# EAGLE design sGPSDO_MCU_1V1 (EAGLE 7.7.0)
sGPSDO - MCU board for the ST32L432KC / STM32 Nucleo board.
Assembly variants: Std, noDCF77

## Sheet 1 of 6: Sockets
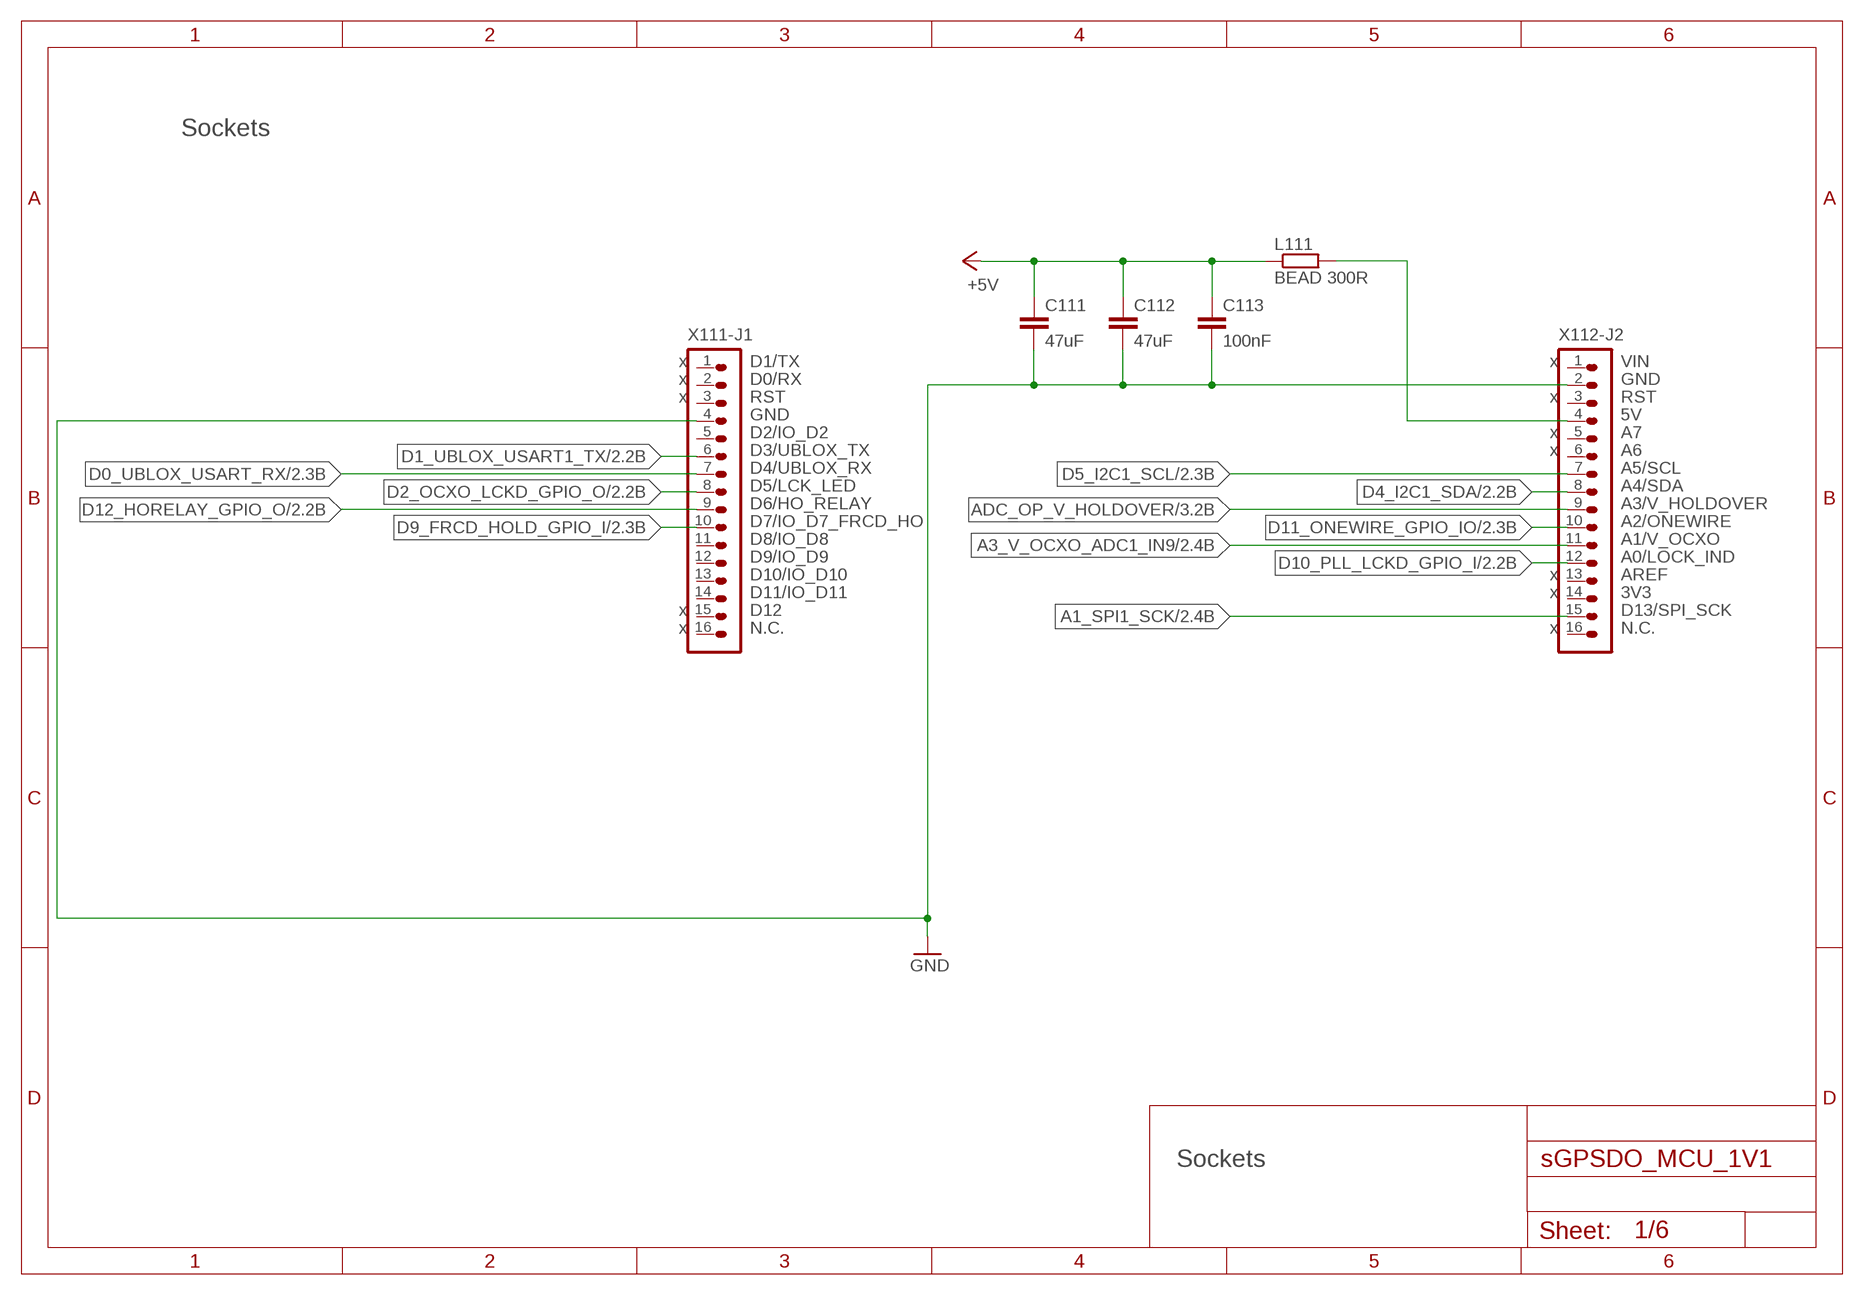
[diagram p0: schematic, sheet 1]

### Parts
C111  47uF  C-EUC0805  [C0805]
C112  47uF  C-EUC0805  [C0805]
C113  100nF  C-EUC0805  [C0805]
L111  BEAD 300R  R-EU_R1206  [R1206]
X111-J1  HEADER-1X16  [1X16]
X112-J2  HEADER-1X16  [1X16]

### Nets
+5V: C111.1 C112.1 C113.1 L111.1 ; also sheet 2,3,4,5,6
A1_SPI1_SCK: X112-J2.15 ; also sheet 2,6
A3_V_OCXO_ADC1_IN9: X112-J2.11 ; also sheet 2
ADC_OP_V_HOLDOVER: X112-J2.9 ; also sheet 3
D0_UBLOX_USART_RX: X111-J1.7 ; also sheet 2
D1_UBLOX_USART1_TX: X111-J1.6 ; also sheet 2
D2_OCXO_LCKD_GPIO_O: X111-J1.8 ; also sheet 2
D4_I2C1_SDA: X112-J2.8 ; also sheet 2
D5_I2C1_SCL: X112-J2.7 ; also sheet 2
D9_FRCD_HOLD_GPIO_I: X111-J1.10 ; also sheet 2
D10_PLL_LCKD_GPIO_I: X112-J2.12 ; also sheet 2
D11_ONEWIRE_GPIO_IO: X112-J2.10 ; also sheet 2
D12_HORELAY_GPIO_O: X111-J1.9 ; also sheet 2
GND: C111.2 C112.2 C113.2 X111-J1.4 X112-J2.2 ; also sheet 2,3,4,5,6
N112: L111.2 X112-J2.4
Unconnected: X111-J1.1 X111-J1.2 X111-J1.3 X111-J1.5 X111-J1.11 X111-J1.12 X111-J1.13 X111-J1.14 X111-J1.15 X111-J1.16 X112-J2.1 X112-J2.3 X112-J2.5 X112-J2.6 X112-J2.13 X112-J2.14 X112-J2.16

### Notes on the sheet
- Sockets
- x | D1/TX | x | VIN
- x | D0/RX | GND
- x | RST | x | RST
- GND | 5V
- D2/IO_D2 | x | A7
- D3/UBLOX_TX | x | A6
- D4/UBLOX_RX | A5/SCL
- D5/LCK_LED | A4/SDA
- D6/HO_RELAY | A3/V_HOLDOVER
- D7/IO_D7_FRCD_HO | A2/ONEWIRE
- D8/IO_D8 | A1/V_OCXO
- D9/IO_D9 | A0/LOCK_IND
- D10/IO_D10 | x | AREF
- D11/IO_D11 | x | 3V3
- x | D12 | D13/SPI_SCK
- x | N.C. | x | N.C.
- Sockets

## Sheet 2 of 6: MCU
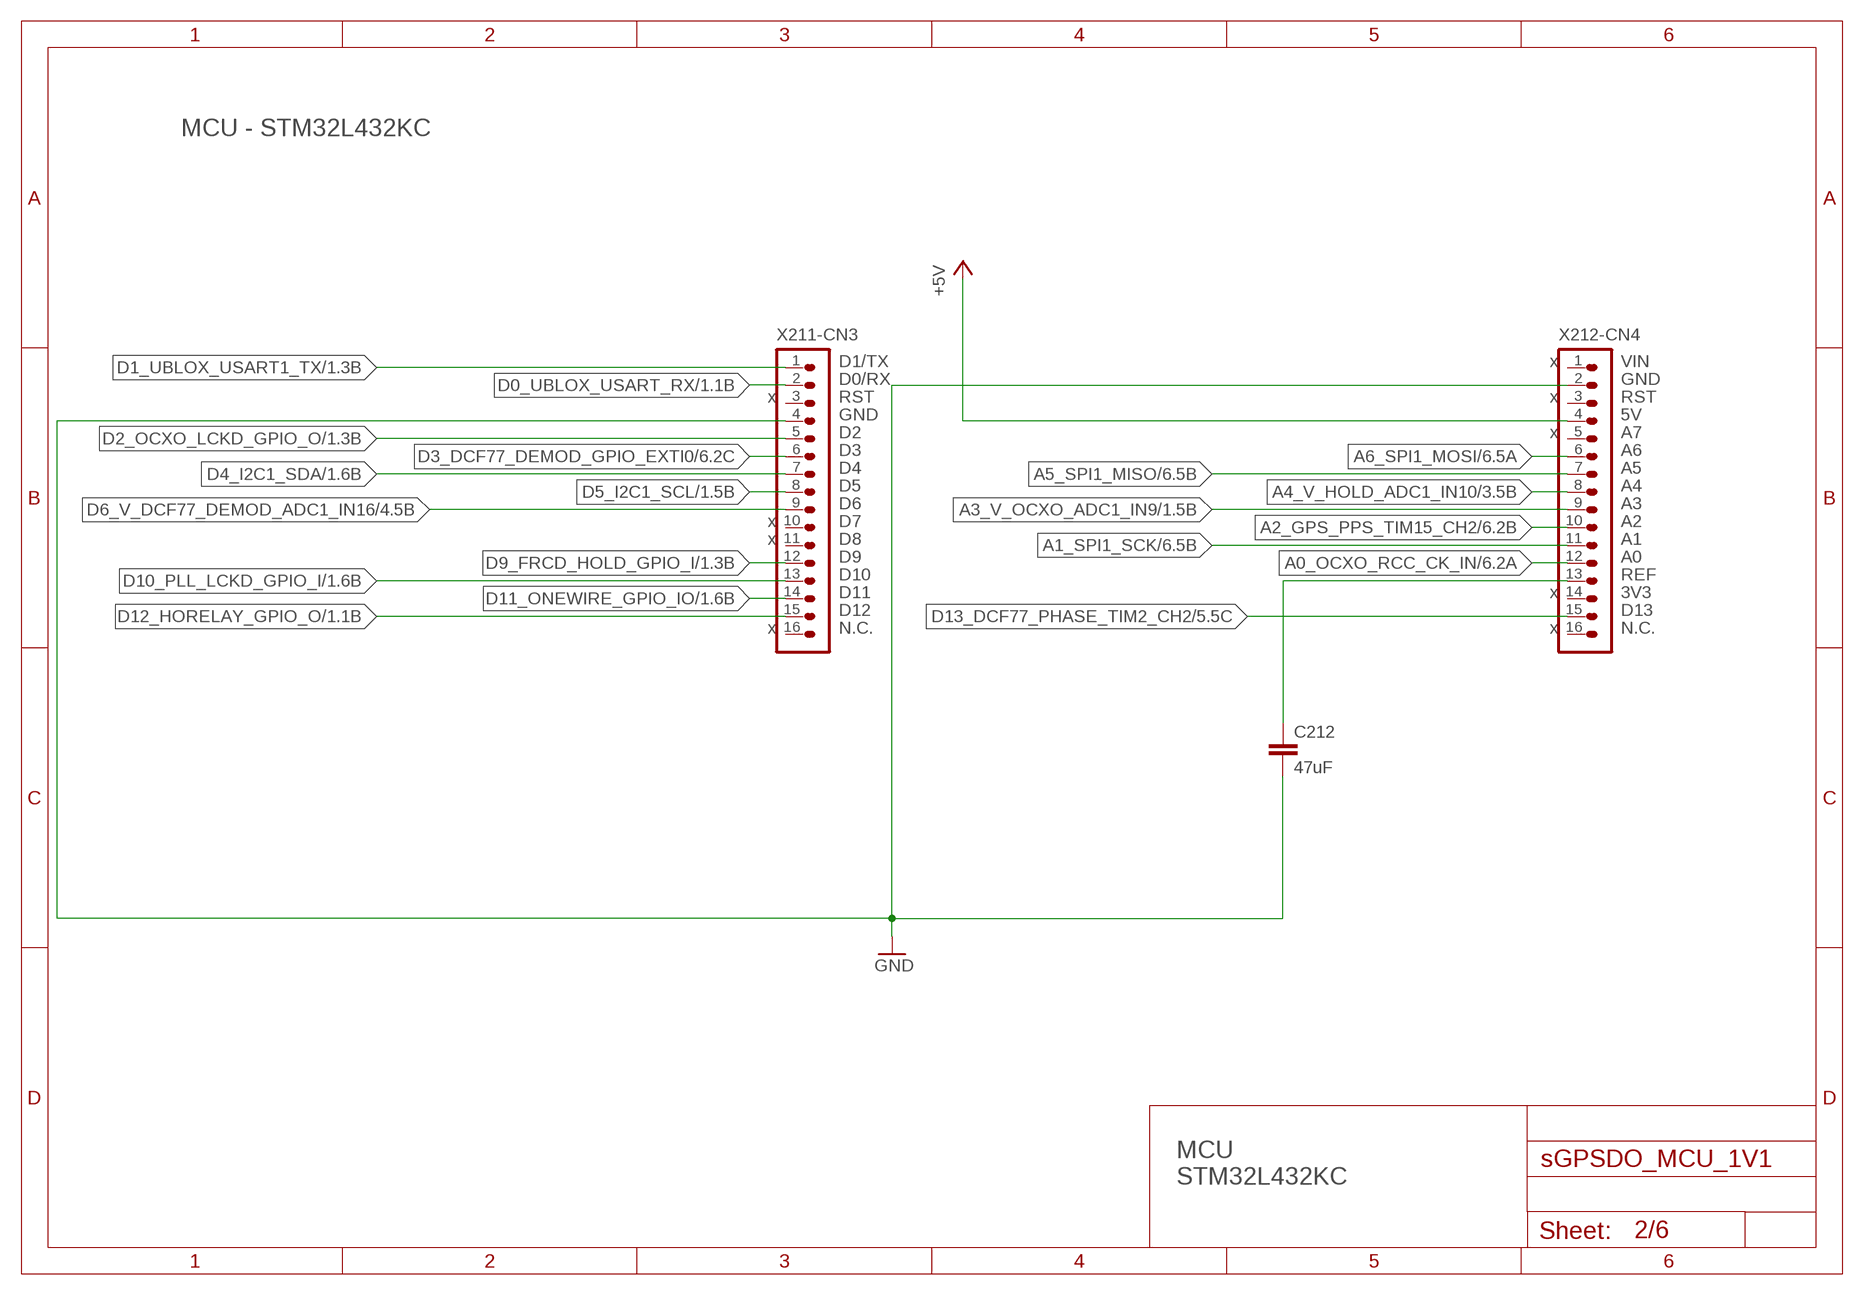
[diagram p1: schematic, sheet 2]

### Parts
C212  47uF  C-EUC0805  [C0805]
X211-CN3  HEADER-1X16  [1X16]
X212-CN4  HEADER-1X16  [1X16]

### Nets
+5V: X212-CN4.4 ; also sheet 1,3,4,5,6
A0_OCXO_RCC_CK_IN: X212-CN4.12 ; also sheet 6
A1_SPI1_SCK: X212-CN4.11 ; also sheet 1,6
A2_GPS_PPS_TIM15_CH2: X212-CN4.10 ; also sheet 6
A3_V_OCXO_ADC1_IN9: X212-CN4.9 ; also sheet 1
A4_V_HOLD_ADC1_IN10: X212-CN4.8 ; also sheet 3
A5_SPI1_MISO: X212-CN4.7 ; also sheet 6
A6_SPI1_MOSI: X212-CN4.6 ; also sheet 6
D0_UBLOX_USART_RX: X211-CN3.2 ; also sheet 1
D1_UBLOX_USART1_TX: X211-CN3.1 ; also sheet 1
D2_OCXO_LCKD_GPIO_O: X211-CN3.5 ; also sheet 1
D3_DCF77_DEMOD_GPIO_EXTI0: X211-CN3.6 ; also sheet 6
D4_I2C1_SDA: X211-CN3.7 ; also sheet 1
D5_I2C1_SCL: X211-CN3.8 ; also sheet 1
D6_V_DCF77_DEMOD_ADC1_IN16: X211-CN3.9 ; also sheet 4
D9_FRCD_HOLD_GPIO_I: X211-CN3.12 ; also sheet 1
D10_PLL_LCKD_GPIO_I: X211-CN3.13 ; also sheet 1
D11_ONEWIRE_GPIO_IO: X211-CN3.14 ; also sheet 1
D12_HORELAY_GPIO_O: X211-CN3.15 ; also sheet 1
D13_DCF77_PHASE_TIM2_CH2: X212-CN4.15 ; also sheet 5
GND: C212.2 X211-CN3.4 X212-CN4.2 ; also sheet 1,3,4,5,6
VREF: C212.1 X212-CN4.13
Unconnected: X211-CN3.3 X211-CN3.10 X211-CN3.11 X211-CN3.16 X212-CN4.1 X212-CN4.3 X212-CN4.5 X212-CN4.14 X212-CN4.16

### Notes on the sheet
- MCU - STM32L432KC
- D1/TX | x | VIN
- D0/RX | GND
- x | RST | x | RST
- GND | 5V
- D2 | x | A7
- D3 | A6
- D4 | A5
- D5 | A4
- D6 | A3
- x | D7 | A2
- x | D8 | A1
- D9 | A0
- D10 | REF
- D11 | x | 3V3
- D12 | D13
- x | N.C. | x | N.C.
- MCU
  STM32L432KC

## Sheet 3 of 6: ADC HOLDOVER Voltage
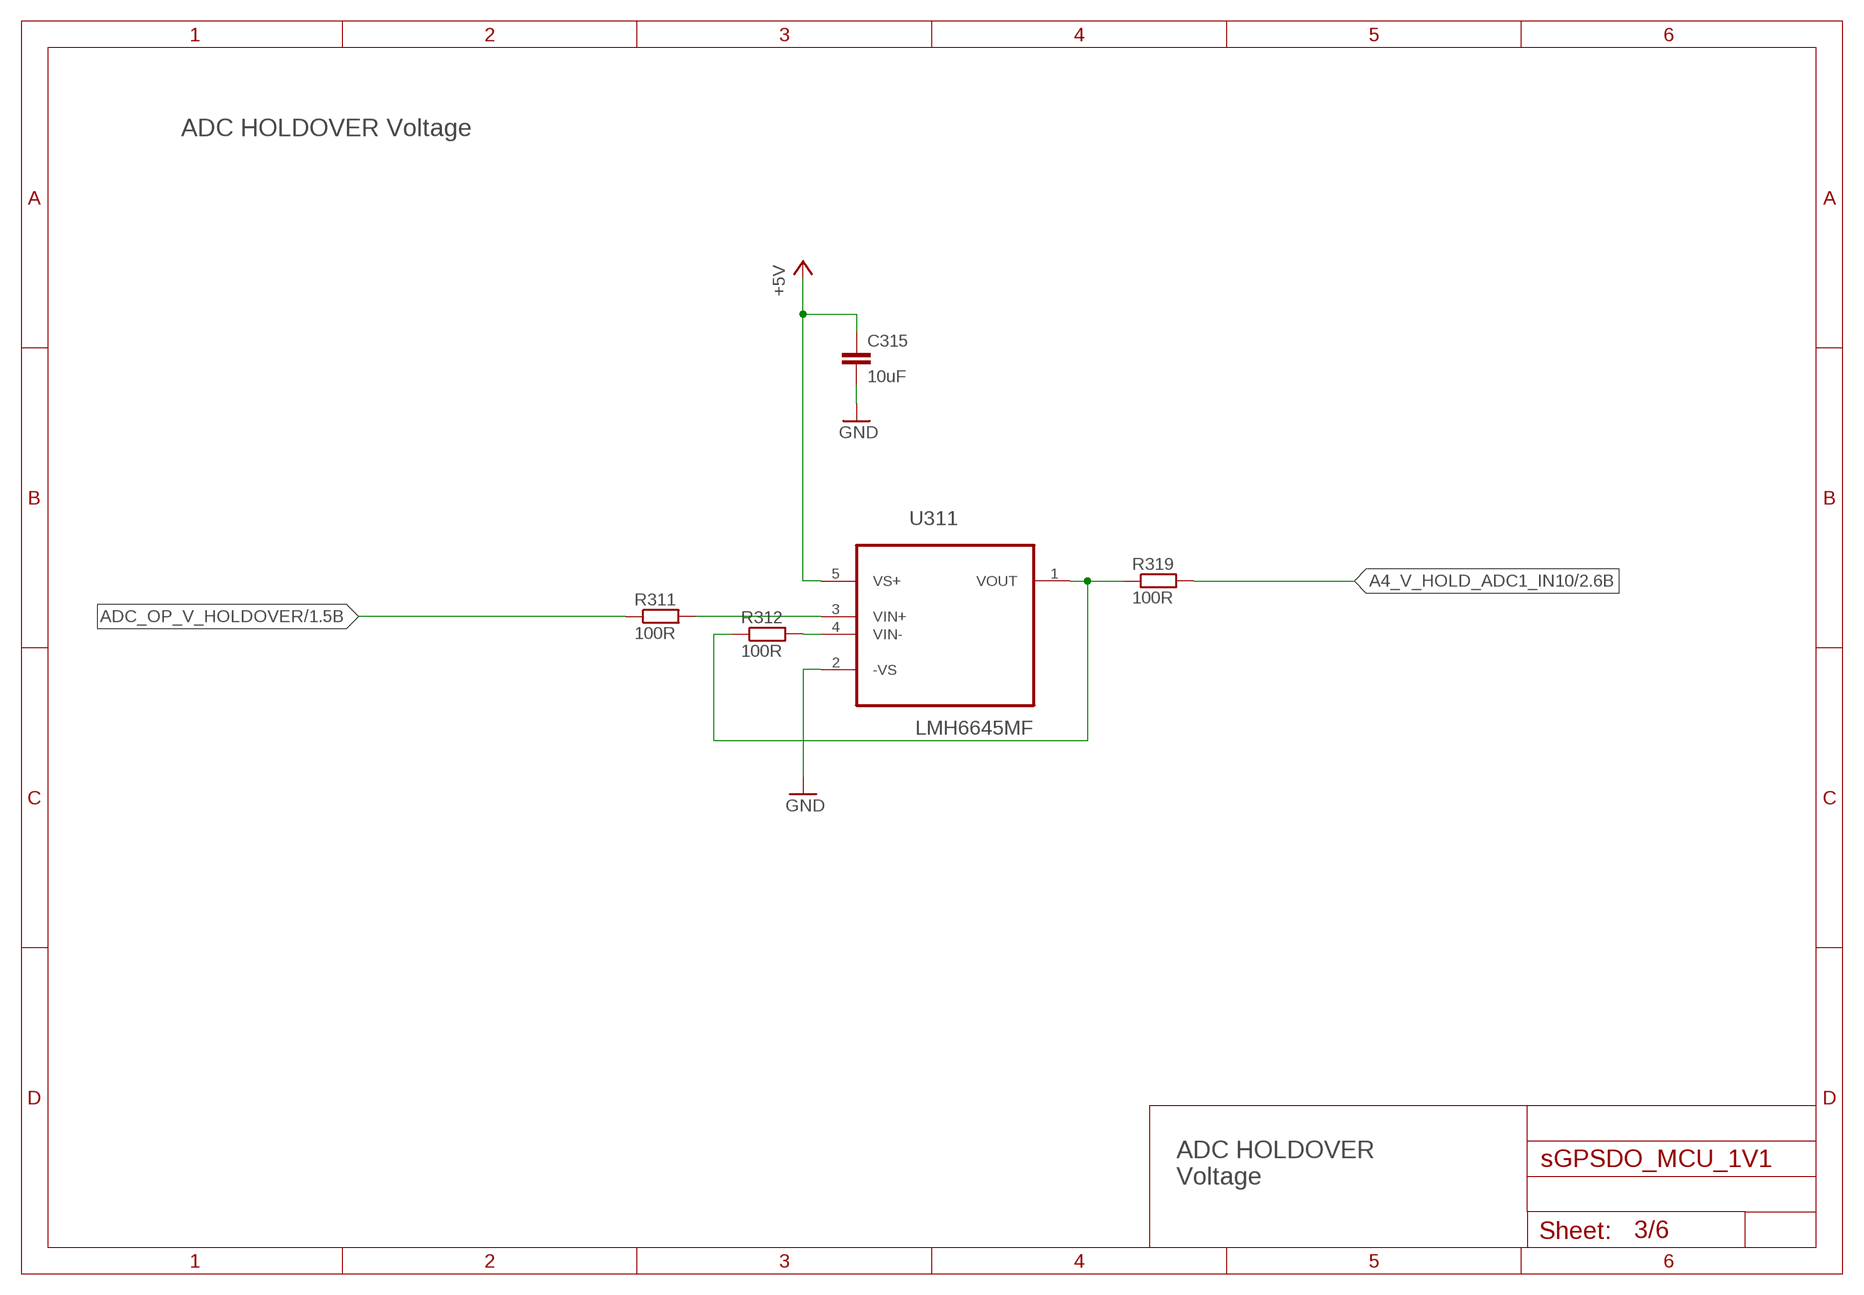
[diagram p2: schematic, sheet 3]

### Parts
C315  10uF  C-EUC0805  [C0805]
R311  100R  R-EU_R0805  [R0805]
R312  100R  R-EU_R0805  [R0805]
R319  100R  R-EU_R0805  [R0805]
U311  LMH6645MF  [SOT-23-5]

### Nets
+5V: C315.1 U311.5(VS+) ; also sheet 1,2,4,5,6
A4_V_HOLD_ADC1_IN10: R319.2 ; also sheet 2
ADC_OP_V_HOLDOVER: R311.1 ; also sheet 1
GND: C315.2 U311.2(-VS) ; also sheet 1,2,4,5,6
N311: R311.2 U311.3(VIN+)
N312: R312.2 U311.4(VIN-)
N319: R312.1 R319.1 U311.1(VOUT)

### Notes on the sheet
- ADC HOLDOVER Voltage
- ADC HOLDOVER
  Voltage

## Sheet 4 of 6: ADC DCF77 DEMOD Voltage
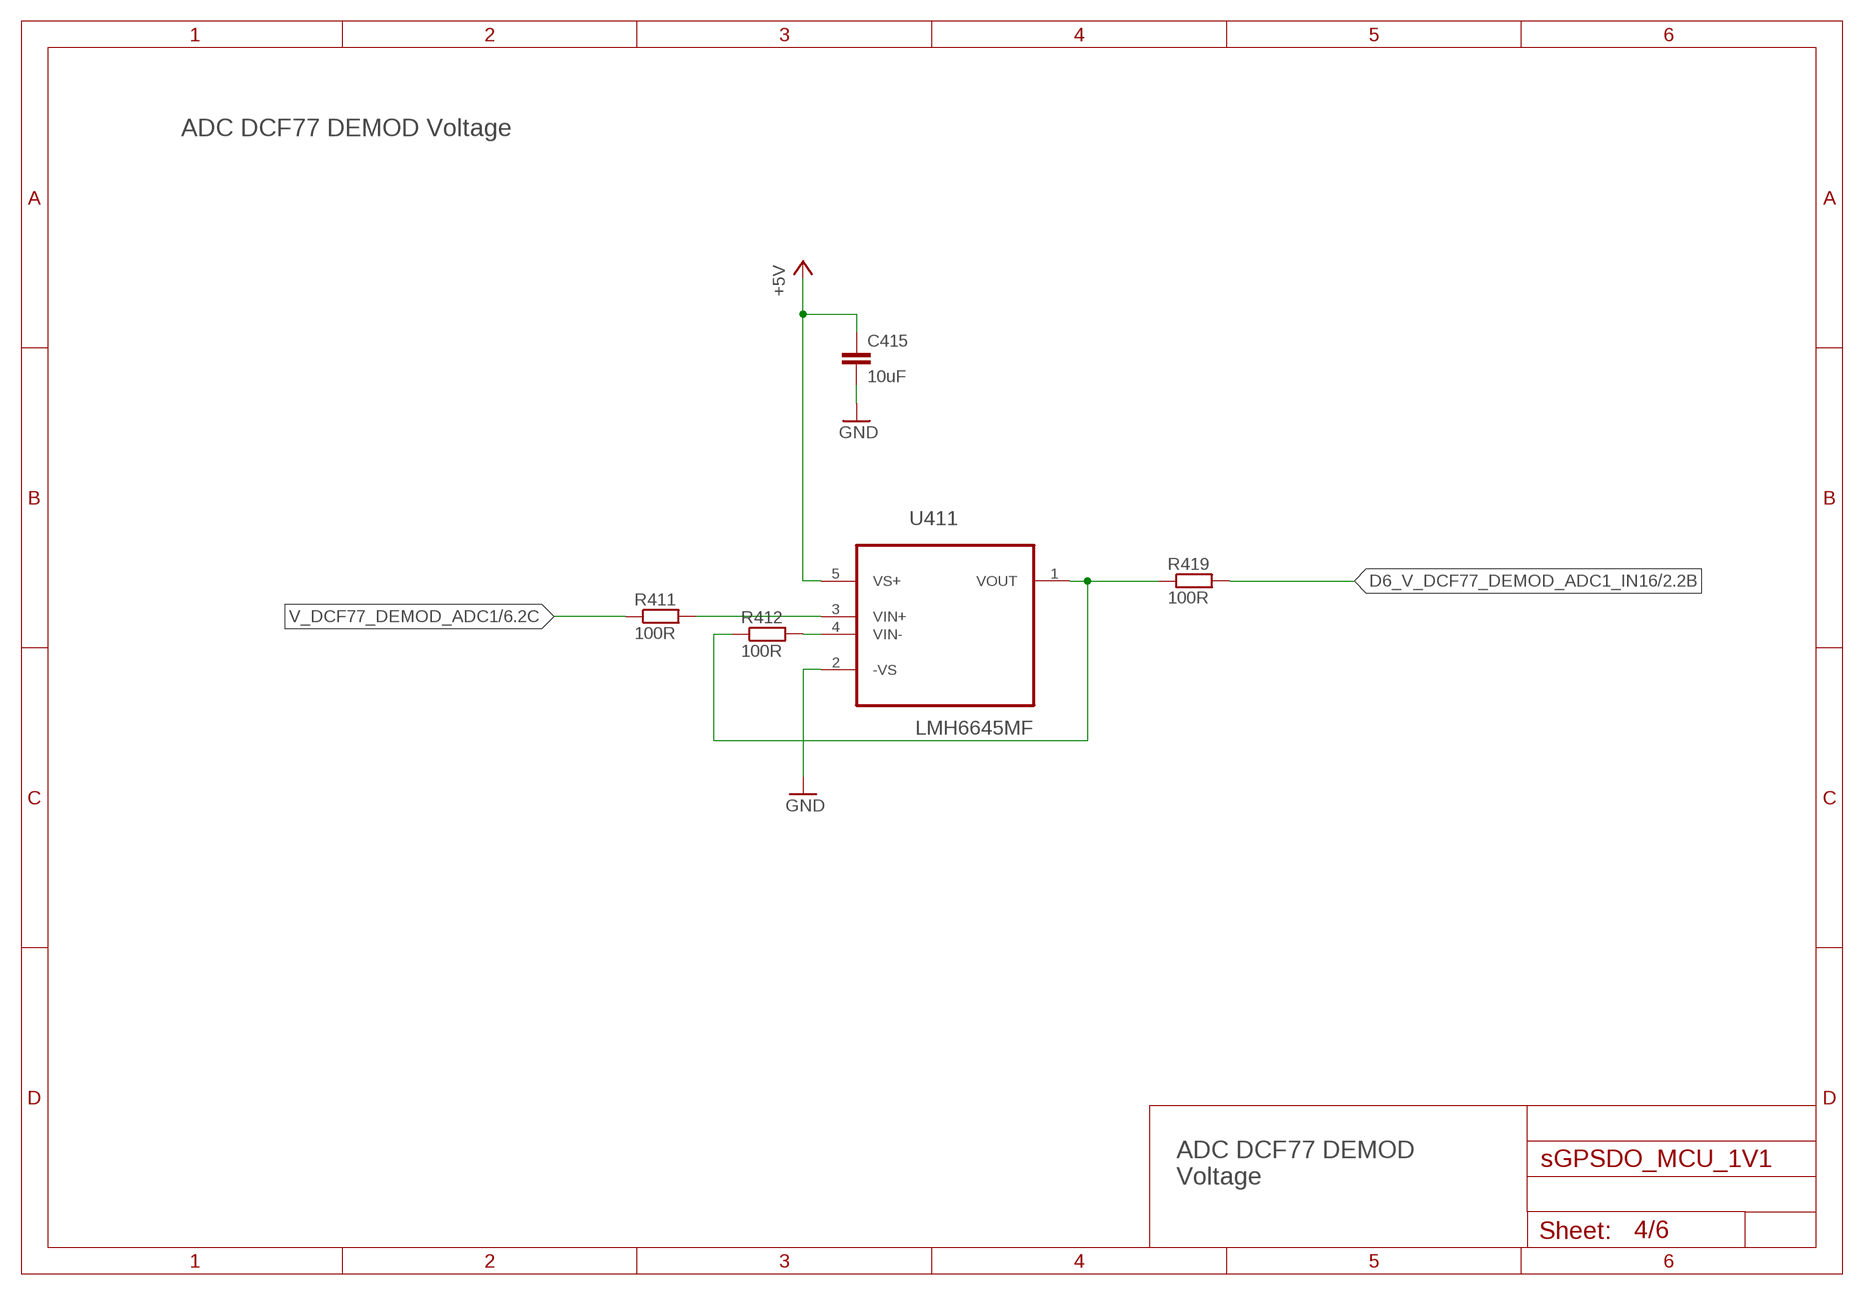
[diagram p3: schematic, sheet 4]

### Parts
C415  10uF  C-EUC0805  [C0805]
R411  100R  R-EU_R0805  [R0805]
R412  100R  R-EU_R0805  [R0805]
R419  100R  R-EU_R0805  [R0805]
U411  LMH6645MF  [SOT-23-5]

### Nets
+5V: C415.1 U411.5(VS+) ; also sheet 1,2,3,5,6
D6_V_DCF77_DEMOD_ADC1_IN16: R419.2 ; also sheet 2
GND: C415.2 U411.2(-VS) ; also sheet 1,2,3,5,6
N411: R411.2 U411.3(VIN+)
N412: R412.2 U411.4(VIN-)
N419: R412.1 R419.1 U411.1(VOUT)
V_DCF77_DEMOD_ADC1: R411.1 ; also sheet 6

### Notes on the sheet
- ADC DCF77 DEMOD Voltage
- ADC DCF77 DEMOD
  Voltage

## Sheet 5 of 6: Divider 31:1
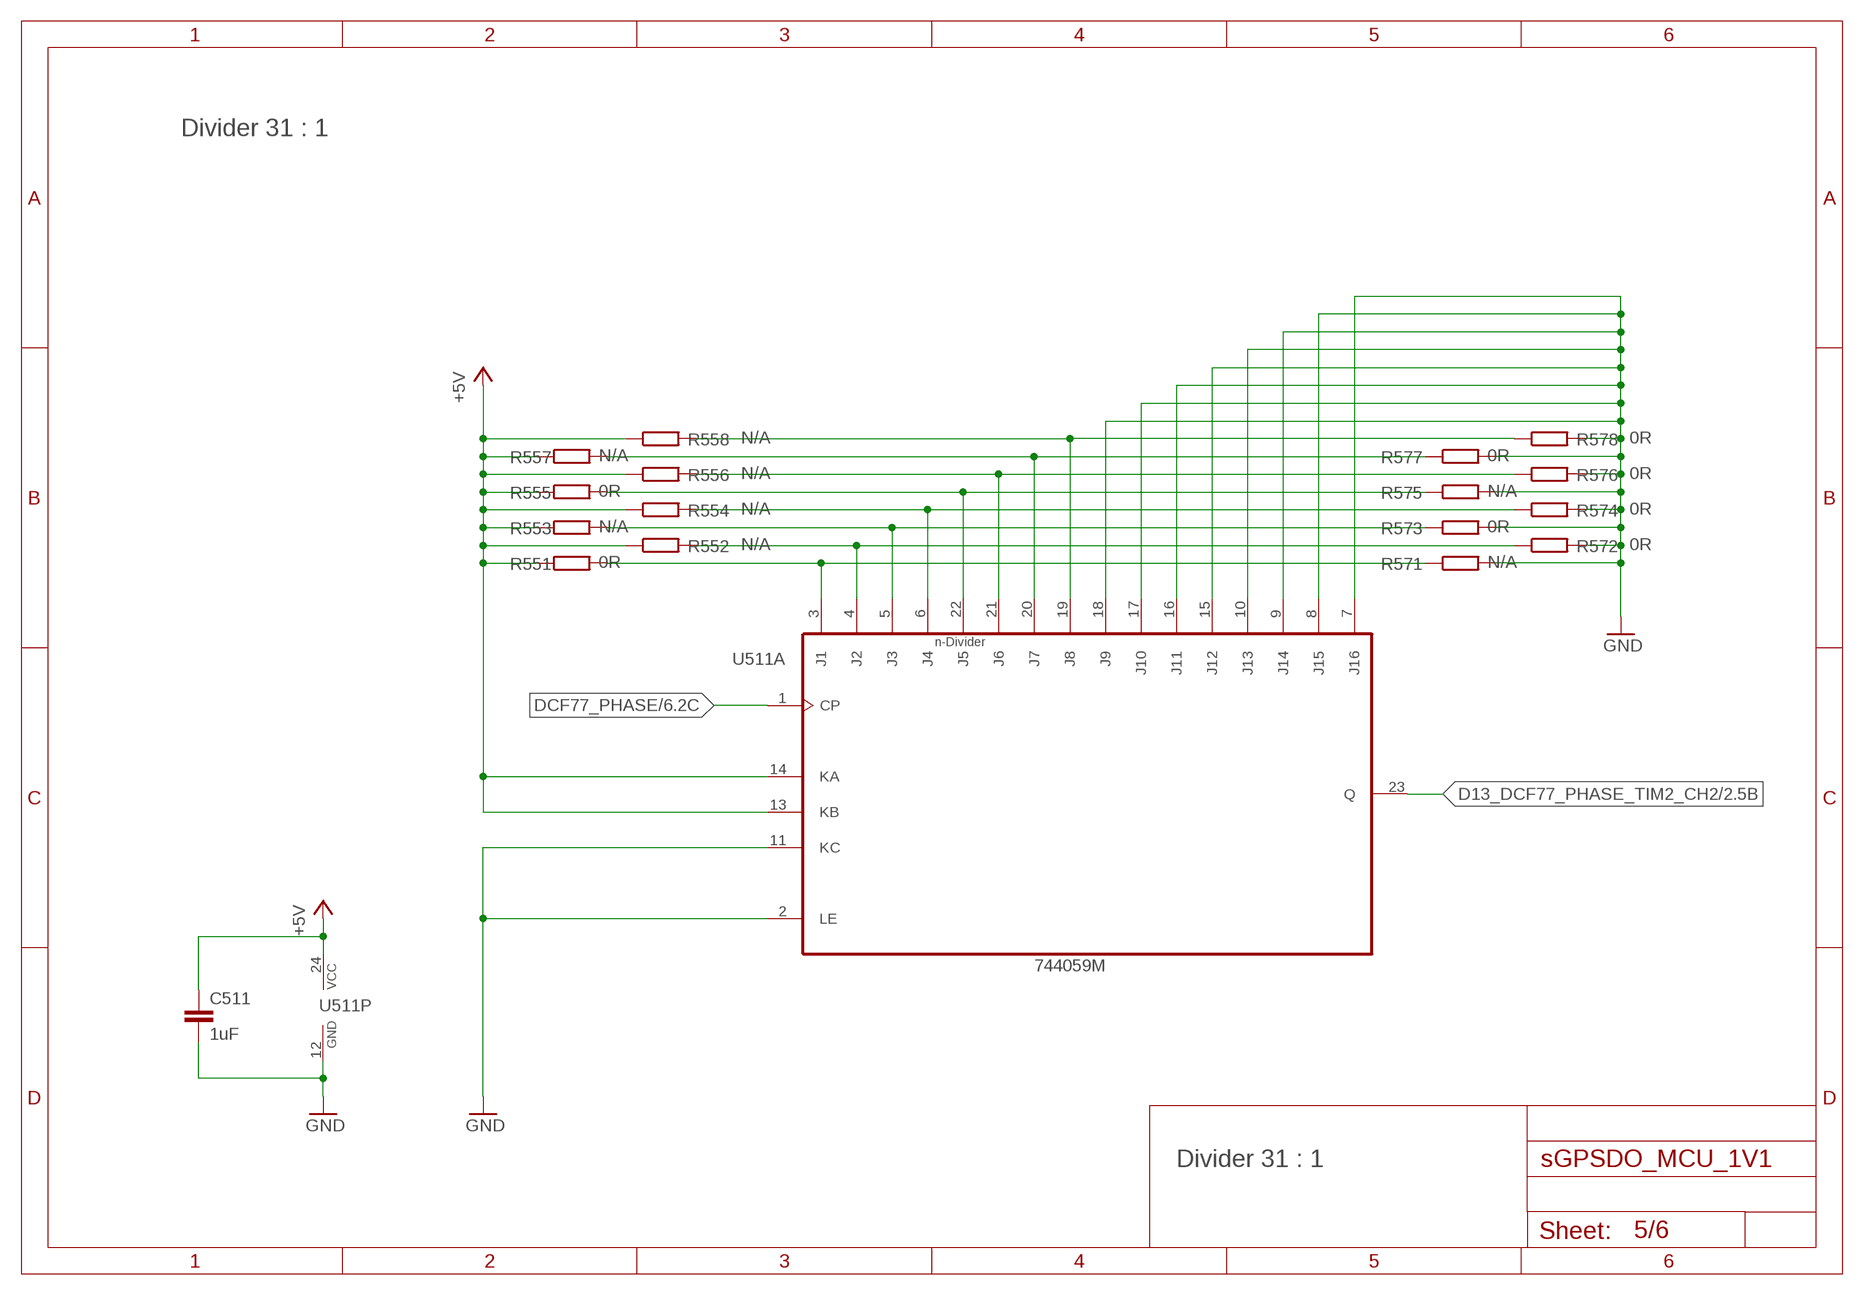
[diagram p4: schematic, sheet 5]

### Parts
C511  1uF  C-EUC0805  [C0805]  (not fitted in variant noDCF77)
R551  0R  R-EU_R0402  [R0402]  (not fitted in variant noDCF77)
R552  N/A  R-EU_R0402  [R0402]  (not fitted in variant noDCF77)
R553  N/A  R-EU_R0402  [R0402]  (not fitted in variant noDCF77)
R554  N/A  R-EU_R0402  [R0402]  (not fitted in variant noDCF77)
R555  0R  R-EU_R0402  [R0402]  (not fitted in variant noDCF77)
R556  N/A  R-EU_R0402  [R0402]  (not fitted in variant noDCF77)
R557  N/A  R-EU_R0402  [R0402]  (not fitted in variant noDCF77)
R558  N/A  R-EU_R0402  [R0402]  (not fitted in variant noDCF77)
R571  N/A  R-EU_R0402  [R0402]  (not fitted in variant noDCF77)
R572  0R  R-EU_R0402  [R0402]  (not fitted in variant noDCF77)
R573  0R  R-EU_R0402  [R0402]  (not fitted in variant noDCF77)
R574  0R  R-EU_R0402  [R0402]  (not fitted in variant noDCF77)
R575  N/A  R-EU_R0402  [R0402]  (not fitted in variant noDCF77)
R576  0R  R-EU_R0402  [R0402]  (not fitted in variant noDCF77)
R577  0R  R-EU_R0402  [R0402]  (not fitted in variant noDCF77)
R578  0R  R-EU_R0402  [R0402]  (not fitted in variant noDCF77)
U511  744059M  [SOIC24]  (not fitted in variant noDCF77)

### Nets
+5V: C511.1 R551.1 R552.1 R553.1 R554.1 R555.1 R556.1 R557.1 R558.1 U511.13(A:KB) U511.14(A:KA) U511.24(P:VCC) ; also sheet 1,2,3,4,6
D13_DCF77_PHASE_TIM2_CH2: U511.23(A:Q) ; also sheet 2
DCF77_PHASE: U511.1(A:CP) ; also sheet 6
GND: C511.2 R571.2 R572.2 R573.2 R574.2 R575.2 R576.2 R577.2 R578.2 U511.2(A:LE) U511.7(A:J16) U511.8(A:J15) U511.9(A:J14) U511.10(A:J13) U511.11(A:KC) U511.12(P:GND) U511.15(A:J12) U511.16(A:J11) U511.17(A:J10) U511.18(A:J9) ; also sheet 1,2,3,4,6
N551: R551.2 R571.1 U511.3(A:J1)
N552: R552.2 R572.1 U511.4(A:J2)
N553: R553.2 R573.1 U511.5(A:J3)
N554: R554.2 R574.1 U511.6(A:J4)
N555: R555.2 R575.1 U511.22(A:J5)
N556: R556.2 R576.1 U511.21(A:J6)
N557: R557.2 R577.1 U511.20(A:J7)
N558: R558.2 R578.1 U511.19(A:J8)

### Notes on the sheet
- Divider 31 : 1
- Divider 31 : 1

## Sheet 6 of 6: Pin-Interface
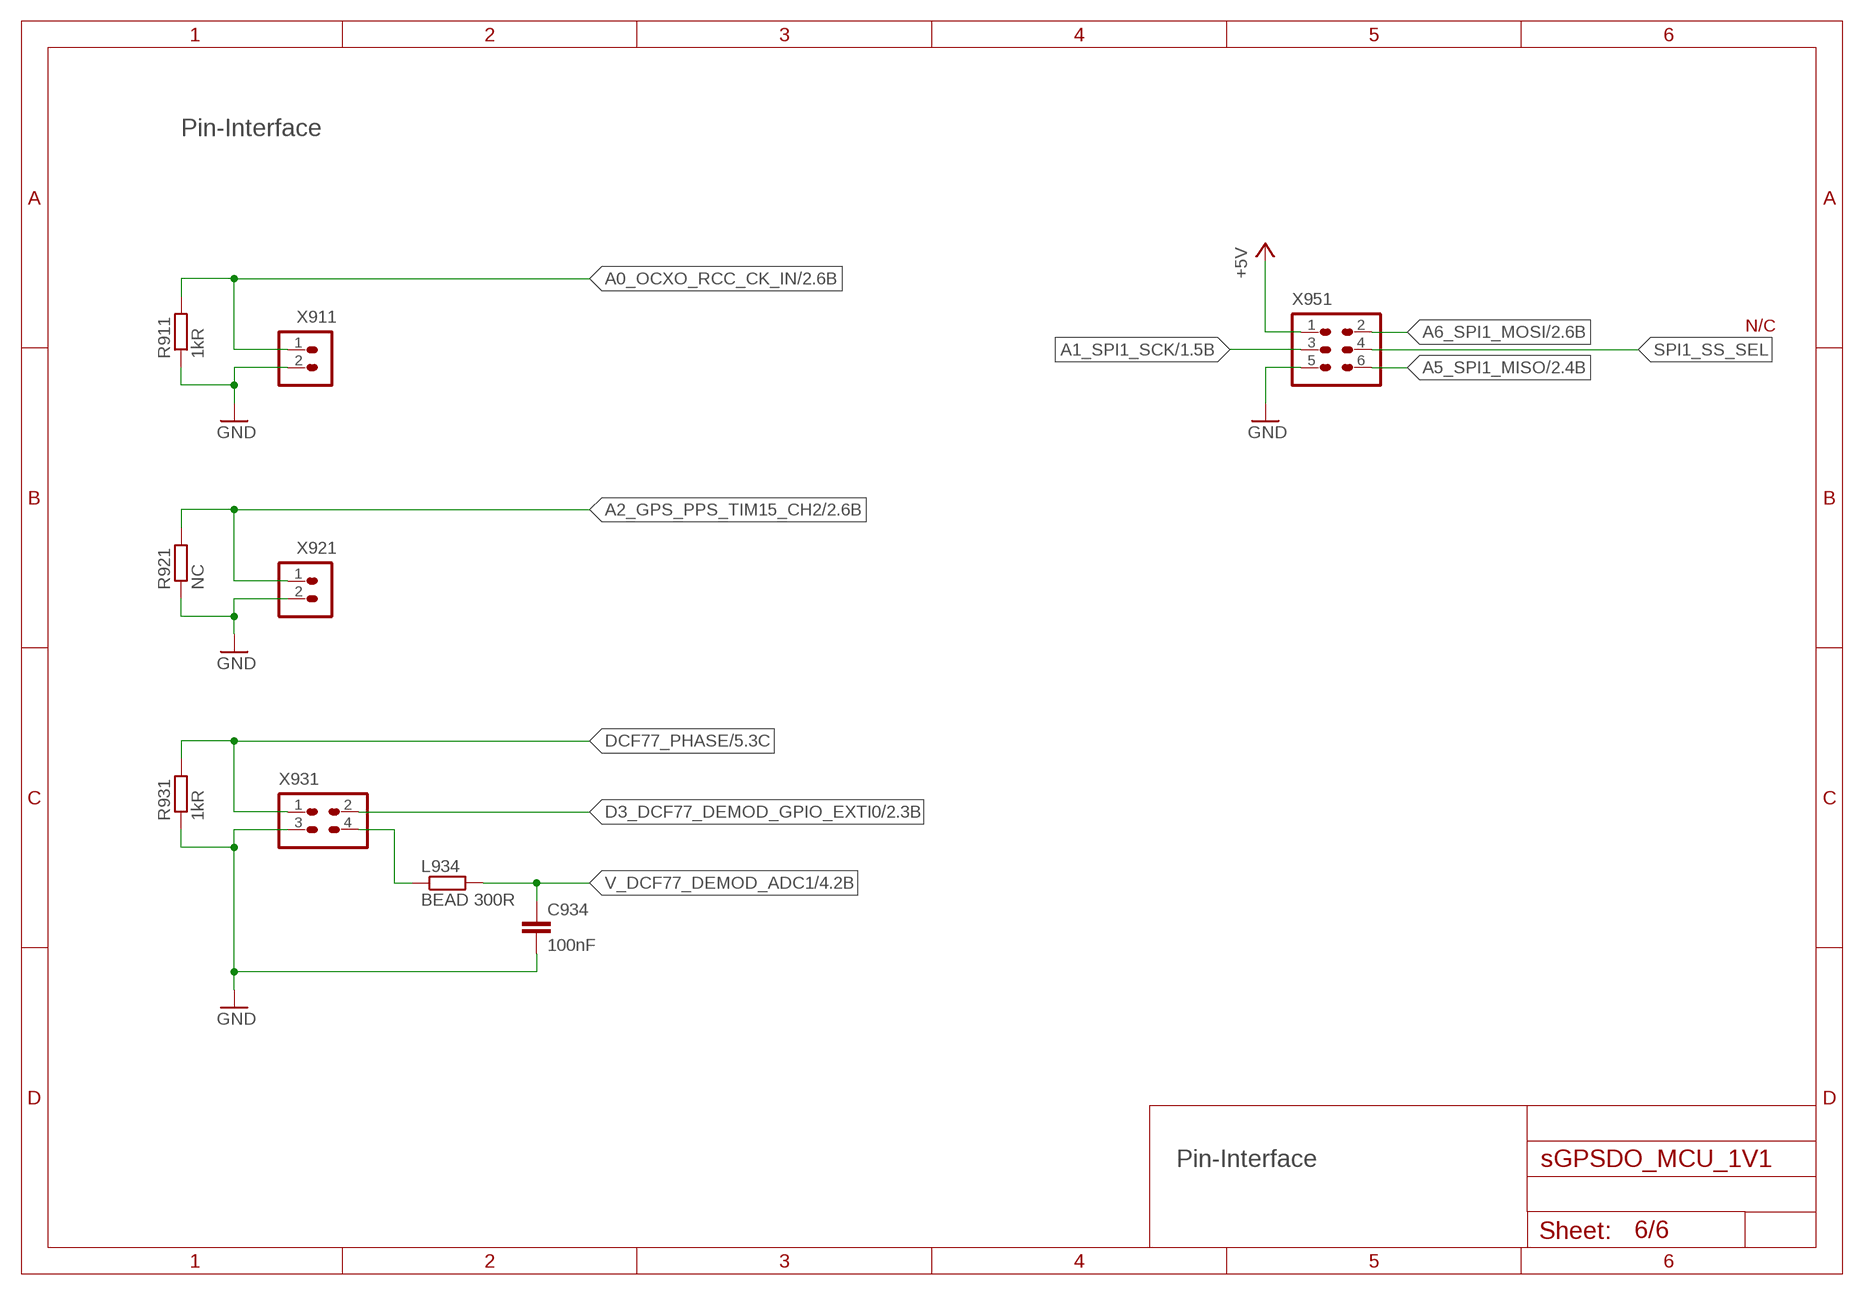
[diagram p5: schematic, sheet 6]

### Parts
C934  100nF  C-EUC0805  [C0805]  (not fitted in variant noDCF77)
L934  BEAD 300R  R-EU_R1206  [R1206]  (not fitted in variant noDCF77)
R911  1kR  R-EU_R0805  [R0805]
R921  NC  R-EU_R0805  [R0805]
R931  1kR  R-EU_R0805  [R0805]  (not fitted in variant noDCF77)
X911  HEADER-1X2  [1X02]
X921  HEADER-1X2  [1X02]
X931  HEADER-2X2  [2X02]  (not fitted in variant noDCF77)
X951  HEADER-2X3  [2X03]

### Nets
+5V: X951.1 ; also sheet 1,2,3,4,5
A0_OCXO_RCC_CK_IN: R911.2 X911.1 ; also sheet 2
A1_SPI1_SCK: X951.3 ; also sheet 1,2
A2_GPS_PPS_TIM15_CH2: R921.2 X921.1 ; also sheet 2
A5_SPI1_MISO: X951.6 ; also sheet 2
A6_SPI1_MOSI: X951.2 ; also sheet 2
D3_DCF77_DEMOD_GPIO_EXTI0: X931.2 ; also sheet 2
DCF77_PHASE: R931.2 X931.1 ; also sheet 5
GND: C934.2 R911.1 R921.1 R931.1 X911.2 X921.2 X931.3 X951.5 ; also sheet 1,2,3,4,5
N934: L934.1 X931.4
SPI1_SS_SEL: X951.4
V_DCF77_DEMOD_ADC1: C934.1 L934.2 ; also sheet 4

### Notes on the sheet
- Pin-Interface
- N/C
- Pin-Interface

## Library data of the parts
C111-C113 C212 C315 C415 C511 C934 = df4iah_rcl:C-EU: CAPACITOR, European symbol
L111 L934 R311 R312 R319 R411 R412 R419 R551-R558 R571-R578 R911 R921 R931 = df4iah_rcl:R-EU_: RESISTOR, European symbol
U311 U411 = df4iah_opamp:LMH6645MF: Wideband, Fixed Gain, JFET-Input AMPLIFIER; OC_FARNELL: 1312813; OC_NEWARK: -; PACKAGE: SOT-23-5; SUPPLIER: Texas Instruments
U511 = df4iah_74xxx:74*4059: 74HC(T)4059 - BCD divider
X111-J1 X112-J2 X211-CN3 X212-CN4 = df4iah_connector:HEADER-1X16: Header 1X16 2.54mm
X911 X921 = df4iah_connector:HEADER-1X2: Header 1X02 2.54mm
X931 = df4iah_connector:HEADER-2X2: Header 2X2 2.54mm
X951 = df4iah_connector:HEADER-2X3: Header 2X3 2.54mm

## Net classes
0 default: width 0.127 mm, drill 0.3 mm, clearance 0.127 mm
1 diff_100R_200u: width 0.203 mm, drill 0.3 mm, clearance 0.203 mm
2 diff_100R_280u: width 0.229 mm, drill 0.3 mm, clearance 0.152 mm
3 diff_100R_360u: width 0.267 mm, drill 0.3 mm, clearance 0.152 mm
4 diff_90R_200u: width 0.216 mm, drill 0.3 mm, clearance 0.152 mm
5 diff_90R_280u: width 0.292 mm, drill 0.3 mm, clearance 0.152 mm
6 diff_90R_360u: width 0.318 mm, drill 0.3 mm, clearance 0.127 mm
7 uni_50R_200u: width 0.343 mm, drill 0.3 mm, clearance 0.381 mm
8 uni_50R_280u: width 0.483 mm, drill 0.3 mm, clearance 0.381 mm
9 uni_50R_360u: width 0.635 mm, drill 0.3 mm, clearance 0.381 mm
10 diff_50R_200u: width 0.508 mm, drill 0.3 mm, clearance 0.127 mm

## Board
DCF77_RX receiver board for the timing and time normal of Europe.
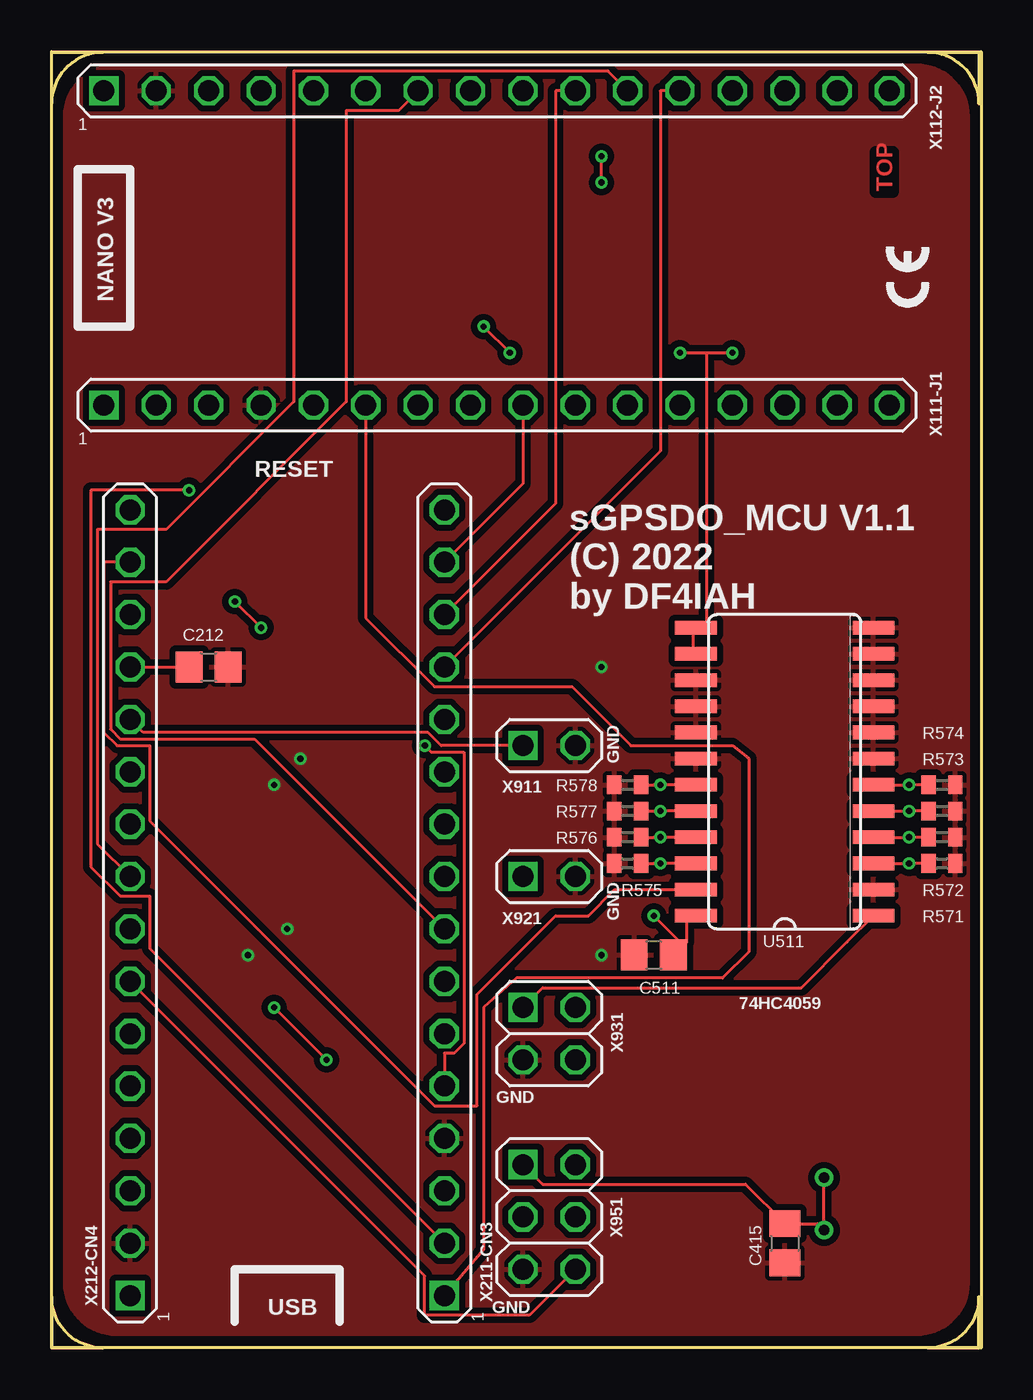
[diagram p6: board, top side]
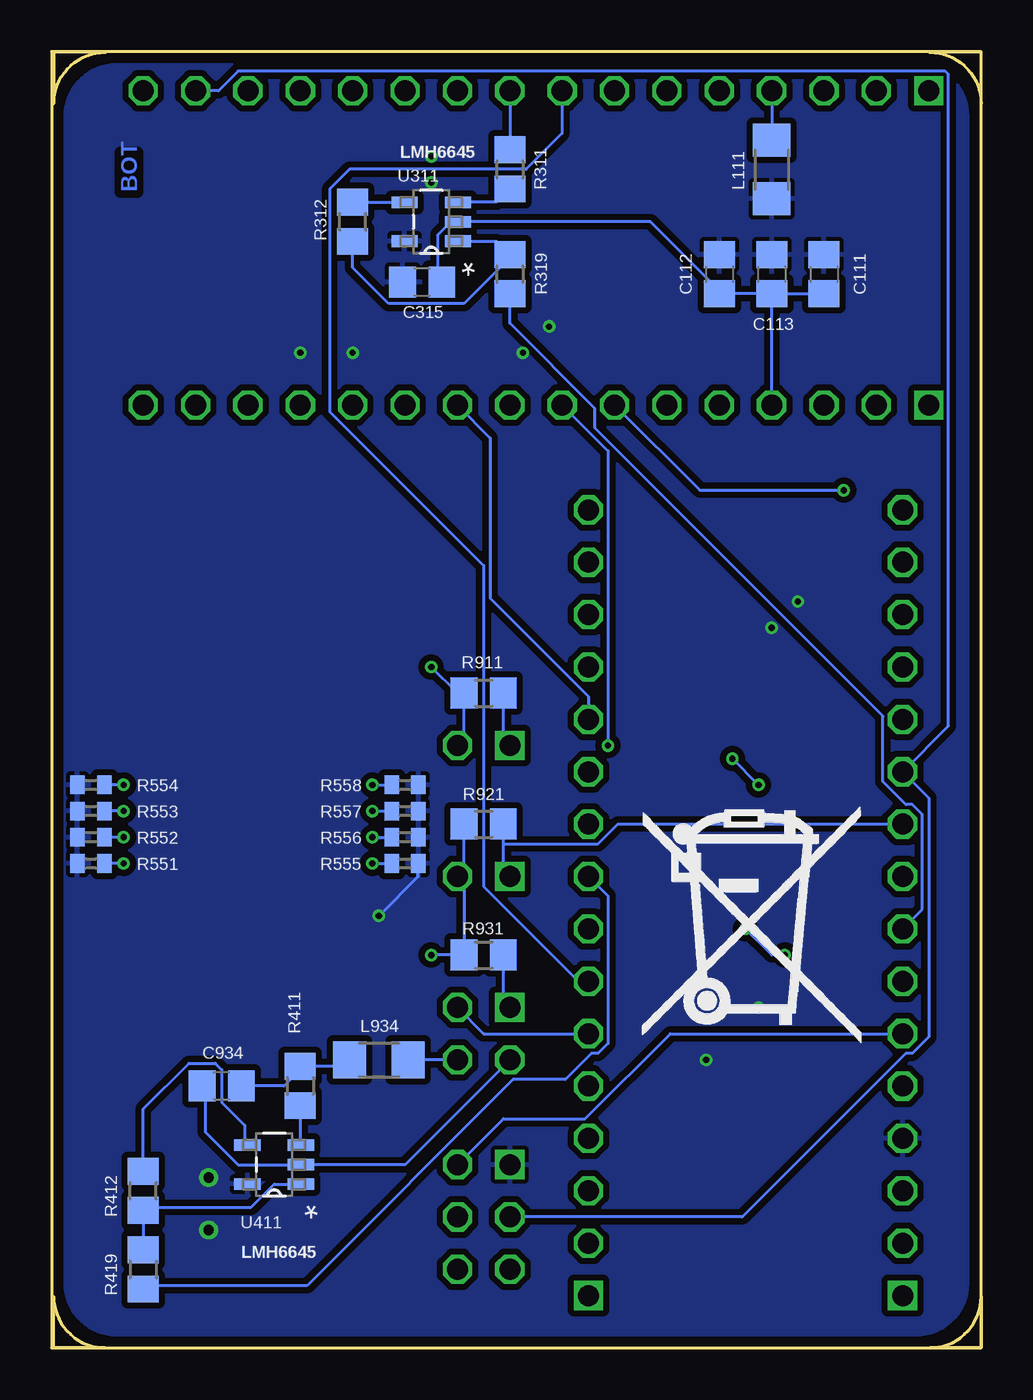
[diagram p7: board, bottom side, seen from below]

Size 45.09 x 62.87 mm. Coordinates in mm from the lower left corner, seen from the top.
Outline: 0,0 0,62.87 45.09,62.87 45.09,0 0,0
Copper layers (1*16): Top__SigA_Pair 0.035mm / dielectric 0.2mm / Bottom__SigB_Pair 0.035mm
Design rules "PCB-POOL Standard_ML6 *": minimum track width 0.15mm, minimum drill 0.3mm, track to track 0.15mm, track to pad 0.15mm, pad to pad 0.15mm, via to via 0.15mm, smd to smd 0.15mm, copper to edge 0.3mm, drill to drill 0.2mm, minimum pad ring 0.2mm, minimum via ring 0.15mm, stop-mask expansion 0.075mm, vias tented up to drill 0mil, thermal gap 0.2mm
Milling: area 0,60.3 to 2.5,62.8; area 0,0 to 2.5,2.5; area 42.5,0 to 45,2.5; area 42.5,60.3 to 45,62.8

### Footprints (pad centres in the part's own frame; a part is rotated, then mirrored left to right if it is on the bottom)
C0805 = smd 1.3 x 1.5: 1 -0.95,0; 2 0.95,0
R1206 = smd 1.6 x 1.803: 1 -1.422,0; 2 1.422,0
R0805 = smd 1.3 x 1.5: 1 -0.95,0; 2 0.95,0
R0402 = smd 0.7 x 0.9: 1 -0.65,0; 2 0.65,0
SOT-23-5 = smd 1.27 x 0.559: 1 -1.295,0.94; 2 -1.295,0; 3 -1.295,-0.94; 4 1.295,-0.94; 5 1.295,0.94
SOIC24 = smd 0.66 x 2.032: 1 -6.985,-4.305; 2 -5.715,-4.305; 3 -4.445,-4.305; 4 -3.175,-4.305; 5 -1.905,-4.305; 6 -0.635,-4.305; 7 0.635,-4.305; 8 1.905,-4.305; 9 3.175,-4.305; 10 4.445,-4.305; 11 5.715,-4.305; 12 6.985,-4.305; 13 6.985,4.305; 14 5.715,4.305; 15 4.445,4.305; 16 3.175,4.305; 17 1.905,4.305; 18 0.635,4.305; 19 -0.635,4.305; 20 -1.905,4.305; 21 -3.175,4.305; 22 -4.445,4.305; 23 -5.715,4.305; 24 -6.985,4.305
1X16 = drill 1.016 square: 1 -19.05,0 | drill 1.016 octagon: 2 -16.51,0; 3 -13.97,0; 4 -11.43,0; 5 -8.89,0; 6 -6.35,0; 7 -3.81,0; 8 -1.27,0; 9 1.27,0; 10 3.81,0; 11 6.35,0; 12 8.89,0; 13 11.43,0; 14 13.97,0; 15 16.51,0; 16 19.05,0
1X02 = drill 1.016 square: 1 0,0 | drill 1.016 octagon: 2 0,2.54
2X02 = drill 1.016 square: 1 -1.27,-1.27 | drill 1.016 octagon: 2 -1.27,1.27; 3 1.27,-1.27; 4 1.27,1.27
2X03 = drill 1.016 square: 1 -2.54,-1.27 | drill 1.016 octagon: 2 -2.54,1.27; 3 0,-1.27; 4 0,1.27; 5 2.54,-1.27; 6 2.54,1.27

### Placement (x,y rotation side)
C111  7.62,52.07 270 bottom
C112  12.7,52.07 270 bottom
C113  10.16,52.07 270 bottom
C212  7.62,33.02 0 top
C315  27.11,51.69 0 bottom
C415  35.56,5.08 270 top
C511  29.21,19.05 180 top
C934  36.83,12.7 180 bottom
L111  10.16,57.15 90 bottom
L934  29.21,13.97 180 bottom
R311  22.86,57.15 270 bottom
R312  30.48,54.61 90 bottom
R319  22.86,52.07 270 bottom
R411  33.02,12.7 270 bottom
R412  40.64,7.62 90 bottom
R419  40.64,3.81 270 bottom
R551  43.18,23.5 0 bottom
R552  43.18,24.77 0 bottom
R553  43.18,26.04 0 bottom
R554  43.18,27.3 0 bottom
R555  27.94,23.5 180 bottom
R556  27.94,24.77 180 bottom
R557  27.94,26.04 180 bottom
R558  27.94,27.3 180 bottom
R571  43.18,23.5 0 top
R572  43.18,24.77 0 top
R573  43.18,26.04 0 top
R574  43.18,27.3 0 top
R575  27.94,23.5 180 top
R576  27.94,24.77 180 top
R577  27.94,26.04 180 top
R578  27.94,27.3 180 top
R911  24.13,31.75 0 bottom
R921  24.13,25.4 0 bottom
R931  24.13,19.05 0 bottom
U311  26.67,54.61 180 bottom
U411  34.29,8.89 180 bottom
U511  35.56,27.94 90 top
X111-J1  21.59,45.72 0 top
X112-J2  21.59,60.96 0 top
X211-CN3  19.05,21.59 90 top
X212-CN4  3.81,21.59 90 top
X911  22.86,29.21 270 top
X921  22.86,22.86 270 top
X931  24.13,15.24 270 top
X951  24.13,6.35 270 top

### Tracks (layer width: path | path; a pad name or v marks a point on that pad's centre or on a via)
+5V  (via drill 0.3, 0.5)
  Top__SigA_Pair 0.15: 30.64,19.53 30.8,19.68 30.8,20.64 31.11,20.95 U511.24 | 30.64,19.53 C511.1 30.64,19.53 | X951.1 23.81,7.94 33.66,7.94 C415.1 | v29.21,20.95 30.64,19.53 | U511.14 31.11,33.66 31.11,34.92 U511.13 31.75,34.92 31.75,48.26
  Top__SigA_Pair 0.152: C415.1 37.15,6.03 v37.47,5.71 v37.47,8.26 | v26.67,56.52 v26.67,57.78 | v20.95,49.53 v22.23,48.26 | v30.48,48.26 31.75,48.26 v33.02,48.26 | v13.34,13.97 v10.79,16.51 | v8.89,36.2 v10.16,34.92
  Bottom__SigB_Pair 0.15: v29.21,20.95 27.3,22.86 R555.1
  pour Bottom__SigB_Pair (isolate 0.305): 41.95,0.64 3.13,0.64 arc-90 0.64,3.13 0.64,59.73 arc-90 3.13,62.23 41.95,62.23 arc-90 44.45,59.73 44.45,3.13 arc-90
A0_OCXO_RCC_CK_IN
  Top__SigA_Pair 0.15: X212-CN4.12 4.45,29.84 18.26,29.84 18.89,29.21 X911.1
  Bottom__SigB_Pair 0.15: X911.1 23.18,29.53 R911.2
A1_SPI1_SCK
  Bottom__SigB_Pair 0.15: X951.3 11.59,6.35 3.65,14.29 3.33,14.29 2.54,15.08 2.54,26.67 X212-CN4.11 1.59,30.16 1.59,61.75 1.75,61.91 36.04,61.91 36.99,60.96 X112-J2.15
A2_GPS_PPS_TIM15_CH2
  Bottom__SigB_Pair 0.15: 23.18,24.45 23.18,23.18 X921.1 | 23.18,24.45 R921.2 | X212-CN4.10 17.62,25.4 18.57,24.45 23.18,24.45
A3_V_OCXO_ADC1_IN9
  Top__SigA_Pair 0.15: X212-CN4.9 2.22,24.45 2.22,39.69 5.56,39.69 11.75,45.88 11.75,61.91 26.99,61.91 X112-J2.11
A4_V_HOLD_ADC1_IN10
  Bottom__SigB_Pair 0.15: R319.2 22.86,49.69 18.73,45.56 18.73,44.61 4.76,30.64 4.76,27.46 3.65,26.35 3.33,26.35 2.86,25.88 2.86,21.27 X212-CN4.8
A5_SPI1_MISO
  Top__SigA_Pair 0.15: X212-CN4.7 18.1,3.49 18.1,1.59 23.18,1.59 X951.6
A6_SPI1_MOSI
  Bottom__SigB_Pair 0.15: X212-CN4.6 15.08,15.24 19.21,11.11 23.18,11.11 X951.2
ADC_OP_V_HOLDOVER
  Bottom__SigB_Pair 0.15: X112-J2.9 R311.1
D0_UBLOX_USART_RX  (via drill 0.3)
  Top__SigA_Pair 0.15: X211-CN3.2 4.76,19.37 4.76,21.91 3.33,21.91 1.91,23.34 1.91,41.59 v6.67,41.59
  Bottom__SigB_Pair 0.15: v6.67,41.59 13.65,41.59 X111-J1.7
D1_UBLOX_USART1_TX
  Top__SigA_Pair 0.15: X211-CN3.1 20.95,4.76 20.95,16.51 22.54,17.94 32.54,17.94 33.81,19.21 33.81,28.57 33.02,29.21 28.1,29.21 25.24,32.07 18.57,32.07 15.24,35.4 X111-J1.6
D2_OCXO_LCKD_GPIO_O  (via drill 0.3)
  Top__SigA_Pair 0.15: X211-CN3.5 19.05,14.29 19.53,14.29 20,14.76 20,28.89 18.41,28.89 v18.1,29.21
  Bottom__SigB_Pair 0.15: v18.1,29.21 18.1,43.5 X111-J1.8
D3_DCF77_DEMOD_GPIO_EXTI0
  Bottom__SigB_Pair 0.15: X211-CN3.6 24.13,15.24 X931.2
D4_I2C1_SDA
  Bottom__SigB_Pair 0.15: X211-CN3.7 19.53,17.78 24.13,22.38 24.13,37.94 31.59,45.4 31.59,56.2 30.64,57.15 22.07,57.15 20.32,58.9 X112-J2.8
D5_I2C1_SCL
  Top__SigA_Pair 0.15: X211-CN3.8 9.84,29.53 3.33,29.53 2.86,30 2.86,37.15 5.56,37.15 14.29,45.88 14.29,60.01 16.83,60.01 X112-J2.7
D6_V_DCF77_DEMOD_ADC1_IN16
  Bottom__SigB_Pair 0.15: X211-CN3.9 18.1,21.91 18.1,14.76 18.57,14.29 18.89,14.29 20.16,13.02 22.7,13.02 32.7,3.02 40.64,3.02 R419.2
D9_FRCD_HOLD_GPIO_I
  Bottom__SigB_Pair 0.15: X211-CN3.12 19.05,31.59 23.81,36.35 23.81,44.13 X111-J1.10
D10_PLL_LCKD_GPIO_I
  Top__SigA_Pair 0.15: X211-CN3.13 29.53,43.5 29.53,60.96 X112-J2.12
D11_ONEWIRE_GPIO_IO
  Top__SigA_Pair 0.15: X211-CN3.14 24.45,40.96 24.45,60.96 X112-J2.10
D12_HORELAY_GPIO_O
  Top__SigA_Pair 0.15: X211-CN3.15 22.86,41.91 X111-J1.9
D13_DCF77_PHASE_TIM2_CH2
  Top__SigA_Pair 0.15: U511.23 27.3,22.23 26.04,20.95 24.45,20.95 20.64,17.14 20.64,11.75 18.57,11.75 4.76,25.56 4.76,29.21 3.17,29.21 2.54,29.84 2.54,38.1 X212-CN4.15
DCF77_PHASE
  Top__SigA_Pair 0.15: X931.1 23.81,17.46 36.35,17.46 38.58,19.68 U511.1
  Bottom__SigB_Pair 0.15: X931.1 23.18,16.83 R931.2
GND  (via drill 0.3)
  Bottom__SigB_Pair 0.15: C315.2 26.19,51.75 26.35,51.91 26.35,53.98 25.72,54.61 U311.2 16.03,54.61 12.7,51.28 C112.2 C113.2 | C113.2 C111.2 | C934.2 37.62,12.7 37.62,10.48 36.04,8.89 U411.2 27.94,8.89 X931.3 | 25.08,22.54 R931.1 | 25.08,22.54 R921.1 | 25.08,22.54 X921.2 | X911.2 25.08,29.53 R911.1 | X111-J1.4 C113.2 | C113.2
  Bottom__SigB_Pair 0.152: R931.1 v26.67,19.05 | v26.67,33.02 25.4,31.75 R911.1 | v9.53,19.05 10.16,19.05 v11.43,20.32 | v10.79,27.3 v12.06,28.57
  pour Top__SigA_Pair (isolate 0.305, rank 3): 41.95,0.64 3.13,0.64 arc-90 0.64,3.13 0.64,59.73 arc-90 3.13,62.23 41.95,62.23 arc-90 44.45,59.73 44.45,3.13 arc-90
N112
  Bottom__SigB_Pair 0.15: X112-J2.4 L111.2
N311
  Bottom__SigB_Pair 0.15: U311.3 25.24,55.56 23.5,55.56 R311.2
N312
  Bottom__SigB_Pair 0.15: U311.4 28.1,55.56 R312.2
N319
  Bottom__SigB_Pair 0.15: U311.1 25.24,53.66 23.5,53.66 R319.1 22.86,52.86 25.08,50.64 28.73,50.64 30.48,52.39 R312.1
N411
  Bottom__SigB_Pair 0.15: R411.2 33.02,9.84 U411.3
N412
  Bottom__SigB_Pair 0.15: R412.2 40.64,11.59 38.42,13.81 37.15,13.81 36.83,13.49 36.83,11.91 35.72,10.79 35.72,9.84 U411.4
N419
  Bottom__SigB_Pair 0.15: U411.1 33.02,7.94 34.29,7.94 35.4,6.83 40.64,6.83 R412.1 R419.1
N551  (via drill 0.3)
  Top__SigA_Pair 0.15: R571.1 v41.59,23.5 U511.3
  Bottom__SigB_Pair 0.15: v41.59,23.5 R571.1
N552  (via drill 0.3)
  Top__SigA_Pair 0.15: R572.1 v41.59,24.77 U511.4
  Bottom__SigB_Pair 0.15: v41.59,24.77 R572.1
N553  (via drill 0.3)
  Top__SigA_Pair 0.15: R573.1 v41.59,26.04 U511.5
  Bottom__SigB_Pair 0.15: v41.59,26.04 R573.1
N554  (via drill 0.3)
  Top__SigA_Pair 0.15: R574.1 v41.59,27.3 U511.6
  Bottom__SigB_Pair 0.15: v41.59,27.3 R574.1
N555  (via drill 0.3)
  Top__SigA_Pair 0.15: R575.1 29.21,23.5 v29.53,23.5 U511.22
  Bottom__SigB_Pair 0.15: v29.53,23.5 R575.1
N556  (via drill 0.3)
  Top__SigA_Pair 0.15: R576.1 29.21,24.77 v29.53,24.77 U511.21
  Bottom__SigB_Pair 0.15: v29.53,24.77 R576.1
N557  (via drill 0.3)
  Top__SigA_Pair 0.15: R577.1 29.21,26.04 v29.53,26.04 U511.20
  Bottom__SigB_Pair 0.15: v29.53,26.04 R577.1
N558  (via drill 0.3)
  Top__SigA_Pair 0.15: R578.1 29.21,27.3 v29.53,27.3 U511.19
  Bottom__SigB_Pair 0.15: v29.53,27.3 R578.1
N934
  Bottom__SigB_Pair 0.15: X931.4 L934.1
V_DCF77_DEMOD_ADC1
  Bottom__SigB_Pair 0.15: L934.2 30.96,13.65 R411.1 33.02,13.49 33.81,12.7 C934.1
VREF
  Top__SigA_Pair 0.15: X212-CN4.13 C212.1

### Text on the board
Top__SigA_Pair: TOP
Bottom__SigB_Pair: BOT
tPlace: NANO V3 | RESET | sGPSDO_MCU V1.1 / (C) 2022 / by DF4IAH | GND | GND | GND | USB | GND
tNames: 74HC4059
bNames: LMH6645 | LMH6645